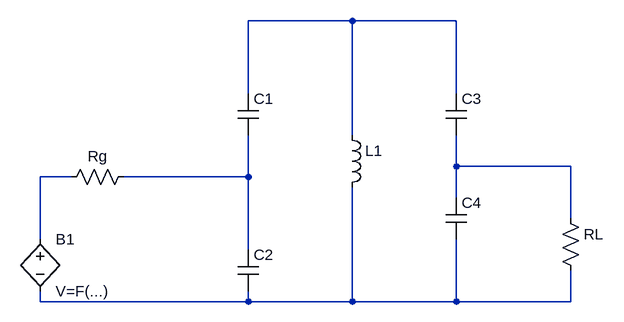
[diagram p0: schematic informe.asc]
informe.asc, the LTspice schematic file:
Version 4
SHEET 1 880 680
WIRE 144 -112 -16 -112
WIRE 304 -112 144 -112
WIRE -16 0 -16 -112
WIRE 304 0 304 -112
WIRE 144 64 144 -112
WIRE 304 112 304 64
WIRE 480 112 304 112
WIRE -288 128 -336 128
WIRE -16 128 -16 64
WIRE -16 128 -208 128
WIRE 304 160 304 112
WIRE 480 192 480 112
WIRE -336 224 -336 128
WIRE -16 240 -16 128
WIRE -336 320 -336 304
WIRE -16 320 -16 304
WIRE -16 320 -336 320
WIRE 144 320 144 144
WIRE 144 320 -16 320
WIRE 304 320 304 224
WIRE 304 320 144 320
WIRE 480 320 480 272
WIRE 480 320 304 320
SYMBOL ind 128 48 R0
SYMATTR InstName L1
SYMATTR Value ""
SYMBOL cap -32 0 R0
SYMATTR InstName C1
SYMATTR Value ""
SYMBOL res -192 112 R90
WINDOW 0 0 56 VBottom 2
WINDOW 3 32 56 VTop 2
SYMATTR InstName Rg
SYMATTR Value ""
SYMBOL bv -336 208 R0
SYMATTR InstName B1
SYMBOL cap -32 240 R0
SYMATTR InstName C2
SYMATTR Value ""
SYMBOL cap 288 0 R0
SYMATTR InstName C3
SYMATTR Value ""
SYMBOL cap 288 160 R0
SYMATTR InstName C4
SYMATTR Value ""
SYMBOL res 464 176 R0
SYMATTR InstName RL
SYMATTR Value ""

The netlist it stands for:
* informe.asc
L1 N001 N005
C1 N001 N004
Rg N004 N003
B1 N003 N005 V=F(...)
C2 N004 N005
C3 N001 N002
C4 N002 N005
RL N002 N005
.backanno
.end